# EAGLE design ADC3_10M (EAGLE 9.6.2)
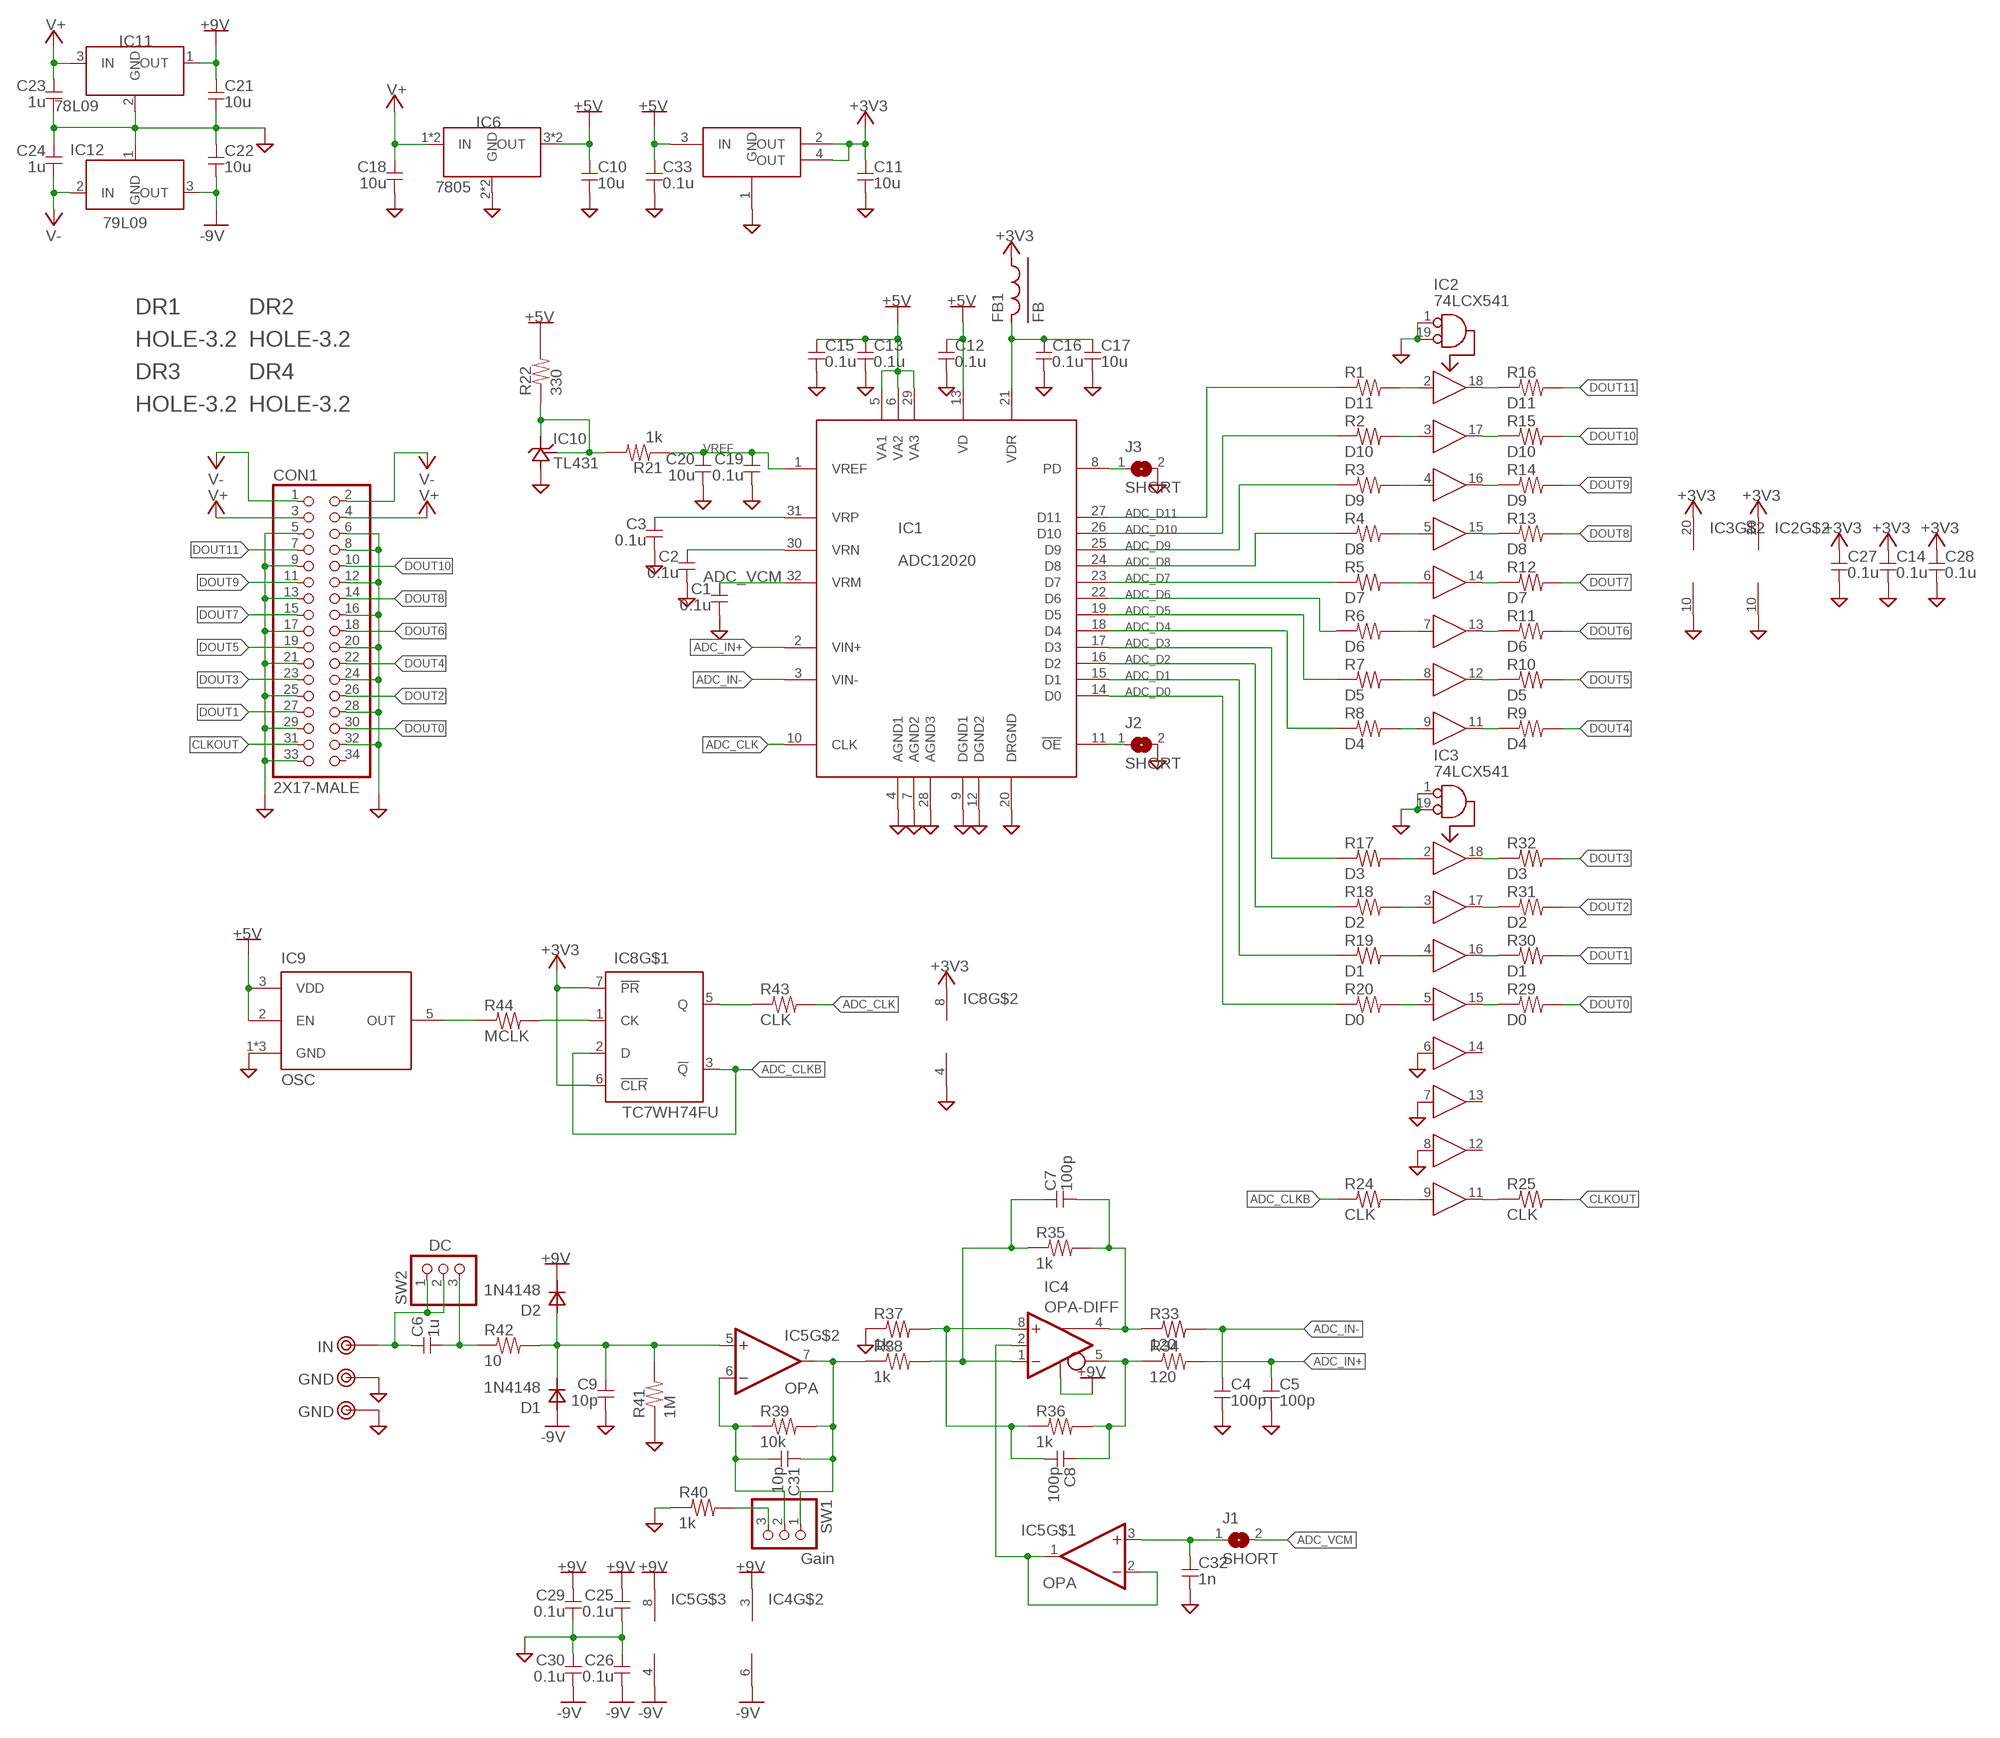
[diagram p0: schematic, sheet 1]

## Parts
C1  0.1u  C-1608  [1608]
C2  0.1u  C-1608  [1608]
C3  0.1u  C-1608  [1608]
C4  100p  C-1608  [1608]
C5  100p  C-1608  [1608]
C6  1u  C-5  [C050]
C7  100p  C-1608  [1608]
C8  100p  C-1608  [1608]
C9  10p  C-1608  [1608]
C10  10u  C-3216  [3216]
C11  10u  C-3216  [3216]
C12  0.1u  C-1608  [1608]
C13  0.1u  C-1608  [1608]
C14  0.1u  C-1608  [1608]
C15  0.1u  C-1608  [1608]
C16  0.1u  C-1608  [1608]
C17  10u  C-2012  [2012]
C18  10u  C-3216  [3216]
C19  0.1u  C-1608  [1608]
C20  10u  C-3216  [3216]
C21  10u  C-2012  [2012]
C22  10u  C-2012  [2012]
C23  1u  C-1608  [1608]
C24  1u  C-1608  [1608]
C25  0.1u  C-1608  [1608]
C26  0.1u  C-1608  [1608]
C27  0.1u  C-1608  [1608]
C28  0.1u  C-1608  [1608]
C29  0.1u  C-1608  [1608]
C30  0.1u  C-1608  [1608]
C31  10p  C-1608  [1608]
C32  1n  C-1608  [1608]
C33  0.1u  C-1608  [1608]
CON1  2X17-MALE  [2X17/90-SWAPPED]
D1  1N4148  DIODE-1N4148W  [SOD123]
D2  1N4148  DIODE-1N4148W  [SOD123]
DR1  HOLE-3.2  [HOLE_3.2]
DR2  HOLE-3.2  [HOLE_3.2]
DR3  HOLE-3.2  [HOLE_3.2]
DR4  HOLE-3.2  [HOLE_3.2]
FB1  FB  [1608-J]
IC1  ADC12020  [TQFP32-08]
IC2  74LCX541  [TSSOP20]
IC3  74LCX541  [TSSOP20]
IC4  OPA-DIFF  [SOP8]
IC5  OPA  OPA-2-SOP  [SOP8]
IC6  7805  78X-3  [TO220-SOP-DUAL]
IC7  AZ1086H-3.3  [SOT223]
IC8  TC7WH74FU  [SSOP8-P-0.65]
IC9  OSC  [MY_OSC]
IC10  TL431  [TO-92]
IC11  78L09  78LX  [TO-92]
IC12  79L09  79LX  [TO-92]
J1  SHORT  SJ-1608  [1608-J]
J2  SHORT  SJ-1608  [1608-J]
J3  SHORT  SJ-1608  [1608-J]
R1  D11  R-1608J  [1608-J]
R2  D10  R-1608J  [1608-J]
R3  D9  R-1608J  [1608-J]
R4  D8  R-1608J  [1608-J]
R5  D7  R-1608J  [1608-J]
R6  D6  R-1608J  [1608-J]
R7  D5  R-1608J  [1608-J]
R8  D4  R-1608J  [1608-J]
R9  D4  R-1608J  [1608-J]
R10  D5  R-1608J  [1608-J]
R11  D6  R-1608J  [1608-J]
R12  D7  R-1608J  [1608-J]
R13  D8  R-1608J  [1608-J]
R14  D9  R-1608J  [1608-J]
R15  D10  R-1608J  [1608-J]
R16  D11  R-1608J  [1608-J]
R17  D3  R-1608J  [1608-J]
R18  D2  R-1608J  [1608-J]
R19  D1  R-1608J  [1608-J]
R20  D0  R-1608J  [1608-J]
R21  1k  R-1608  [1608]
R22  330  R-1608  [1608]
R24  CLK  R-1608J  [1608-J]
R25  CLK  R-1608J  [1608-J]
R29  D0  R-1608J  [1608-J]
R30  D1  R-1608J  [1608-J]
R31  D2  R-1608J  [1608-J]
R32  D3  R-1608J  [1608-J]
R33  120  R-1608  [1608]
R34  120  R-1608  [1608]
R35  1k  R-1608  [1608]
R36  1k  R-1608  [1608]
R37  1k  R-1608  [1608]
R38  1k  R-1608  [1608]
R39  10k  R-1608  [1608]
R40  1k  R-1608  [1608]
R41  1M  R-1608  [1608]
R42  10  R-1608  [1608]
R43  CLK  R-1608J  [1608-J]
R44  MCLK  R-1608J  [1608-J]
SW1  Gain  SW-1X3  [1X03]
SW2  DC  SW-1X3  [1X03]
TP1  IN  TESTPIN  [TESTPIN]
TP2  GND  TESTPIN  [TESTPIN]
TP3  GND  TESTPIN  [TESTPIN]

## Nets
+3V3: C11.1 C14.1 C27.1 C28.1 FB1.1 IC2.20(V+) IC3.20(V+) IC7.2(OUT) IC7.4(OUT) IC8.6(!CLR) IC8.7(!PR) IC8.8(V+)
+5V: C10.1 C12.1 C13.1 C15.1 C33.1 IC1.5(VA1) IC1.6(VA2) IC1.13(VD) IC1.29(VA3) IC6.3(OUT) IC6.6(OUT) IC7.3(IN) IC9.2(EN) IC9.3(VDD) R22.2
+9V: C21.1 C25.1 C29.1 D2.2(K) IC4.3(V+) IC4.7(EN) IC5.8(V+) IC11.1(OUT)
-9V: C22.2 C26.2 C30.2 D1.1(A) IC4.6(V-) IC5.4(V-) IC12.3(OUT)
ADC_CLK: IC1.10(CLK) R43.2
ADC_CLKB: IC8.2(D) IC8.3(!Q) R24.1
ADC_D0: IC1.14(D0) R20.1
ADC_D1: IC1.15(D1) R19.1
ADC_D2: IC1.16(D2) R18.1
ADC_D3: IC1.17(D3) R17.1
ADC_D4: IC1.18(D4) R8.1
ADC_D5: IC1.19(D5) R7.1
ADC_D6: IC1.22(D6) R6.1
ADC_D7: IC1.23(D7) R5.1
ADC_D8: IC1.24(D8) R4.1
ADC_D9: IC1.25(D9) R3.1
ADC_D10: IC1.26(D10) R2.1
ADC_D11: IC1.27(D11) R1.1
ADC_IN+: C5.1 IC1.2(VIN+) R34.2
ADC_IN-: C4.1 IC1.3(VIN-) R33.2
ADC_VCM: C1.1 IC1.32(VRM) J1.2
CLKOUT: CON1.31 R25.2
DOUT0: CON1.30 R29.2
DOUT1: CON1.27 R30.2
DOUT2: CON1.26 R31.2
DOUT3: CON1.23 R32.2
DOUT4: CON1.22 R9.2
DOUT5: CON1.19 R10.2
DOUT6: CON1.18 R11.2
DOUT7: CON1.15 R12.2
DOUT8: CON1.14 R13.2
DOUT9: CON1.11 R14.2
DOUT10: CON1.10 R15.2
DOUT11: CON1.7 R16.2
GND: C1.2 C2.2 C3.2 C4.2 C5.2 C9.2 C10.2 C11.2 C12.2 C13.2 C14.2 C15.2 C16.2 C17.2 C18.2 C19.2 C20.2 C21.2 C22.1 C23.2 C24.1 C25.2 C26.1 C27.2 C28.2 C29.2 C30.1 C32.2 C33.2 CON1.5 CON1.6 CON1.8 CON1.9 CON1.12 CON1.13 CON1.16 CON1.17 CON1.20 CON1.21 CON1.24 CON1.25 CON1.28 CON1.29 CON1.32 CON1.33 IC1.4(AGND1) IC1.7(AGND2) IC1.9(DGND1) IC1.12(DGND2) IC1.20(DRGND) IC1.28(AGND3) IC2.1(!OE1) IC2.10(V-) IC2.19(!OE2) IC3.1(!OE1) IC3.6(IN5) IC3.7(IN6) IC3.8(IN7) IC3.10(V-) IC3.19(!OE2) IC6.2(GND) IC6.5(GND) IC7.1(GND) IC8.4(V-) IC9.1(GND) IC9.4(GND) IC9.6(GND) IC10.2(GND) IC11.2(GND) IC12.1(GND) J2.2 J3.2 R37.1 R40.1 R41.1 TP2.1 TP3.1
N$1: C7.2 IC4.4(+OUT) R33.1 R35.2
N$2: C8.1 IC4.5(-OUT) R34.1 R36.2
N$3: C8.2 IC4.8(+IN) R36.1 R37.2
N$4: R40.2 SW1.3
N$12: C7.1 IC4.1(-IN) R35.1 R38.2
N$13: IC4.2(CM) IC5.1(OUT) IC5.2(-IN)
N$14: C32.1 IC5.3(+IN) J1.1
N$15: C31.1 IC5.7(OUT) R38.1 R39.2 SW1.1
N$16: C31.2 IC5.6(-IN) R39.1 SW1.2
N$17: IC2.2(IN1) R1.2
N$18: IC2.3(IN2) R2.2
N$19: IC2.4(IN3) R3.2
N$20: IC2.5(IN4) R4.2
N$21: IC2.6(IN5) R5.2
N$22: IC2.7(IN6) R6.2
N$23: IC2.8(IN7) R7.2
N$24: IC2.9(IN8) R8.2
N$25: IC2.11(OUT8) R9.1
N$26: IC2.12(OUT7) R10.1
N$27: IC2.13(OUT6) R11.1
N$28: IC2.14(OUT5) R12.1
N$29: IC2.15(OUT4) R13.1
N$30: IC2.16(OUT3) R14.1
N$31: IC2.17(OUT2) R15.1
N$32: IC2.18(OUT1) R16.1
N$33: C16.1 C17.1 FB1.2 IC1.21(VDR)
N$34: C6.1 SW2.1 SW2.2 TP1.1
N$35: C6.2 R42.1 SW2.3
N$37: C9.1 D1.2(K) D2.1(A) IC5.5(+IN) R41.2 R42.2
N$38: IC1.11(!OE) J2.1
N$39: IC1.8(PD) J3.1
N$44: IC10.1(REF) IC10.3(OUT) R21.2 R22.1
N$49: IC3.2(IN1) R17.2
N$50: IC3.3(IN2) R18.2
N$51: IC3.4(IN3) R19.2
N$52: IC3.5(IN4) R20.2
N$56: IC3.9(IN8) R24.2
N$57: IC3.11(OUT8) R25.1
N$61: IC3.15(OUT4) R29.1
N$62: IC3.16(OUT3) R30.1
N$63: IC3.17(OUT2) R31.1
N$64: IC3.18(OUT1) R32.1
N$65: IC8.5(Q) R43.1
N$66: C2.1 IC1.30(VRN)
N$67: C3.1 IC1.31(VRP)
N$68: IC8.1(CK) R44.2
N$69: IC9.5(OUT) R44.1
V+: C18.1 C23.1 CON1.3 CON1.4 IC6.1(IN) IC6.4(IN) IC11.3(IN)
V-: C24.2 CON1.1 CON1.2 IC12.2(IN)
VREF: C19.1 C20.1 IC1.1(VREF) R21.1
Unconnected: CON1.34 IC3.12(OUT7) IC3.13(OUT6) IC3.14(OUT5)

## Library data of the parts
C1-C33 = my_rcl:C
CON1 = my_connector:2X17-MALE
D1 D2 = my_rcl:DIODE
DR1-DR4 = my_connector:HOLE-3.2
FB1 = my_rcl:FB
IC1 = my_ic:ADC12020
IC2 IC3 = my_ic:74LCX541
IC4 = my_ic:OPA-DIFF
IC5 = my_ic:OPA-2
IC6 = my_ic:78X
IC7 = my_ic:AZ1086?-*
IC8 = my_ic:TC7WH74FU
IC9 = my_ic:OSC
IC10 = my_ic:TL431
IC11 = my_ic:78LX
IC12 = my_ic:79LX
J1-J3 = my_rcl:SJ
R1-R22 R24 R25 R29-R44 = my_rcl:R
SW1 SW2 = my_connector:SW-1X3: PIN HEADER
TP1-TP3 = my_connector:TESTPIN

## Board
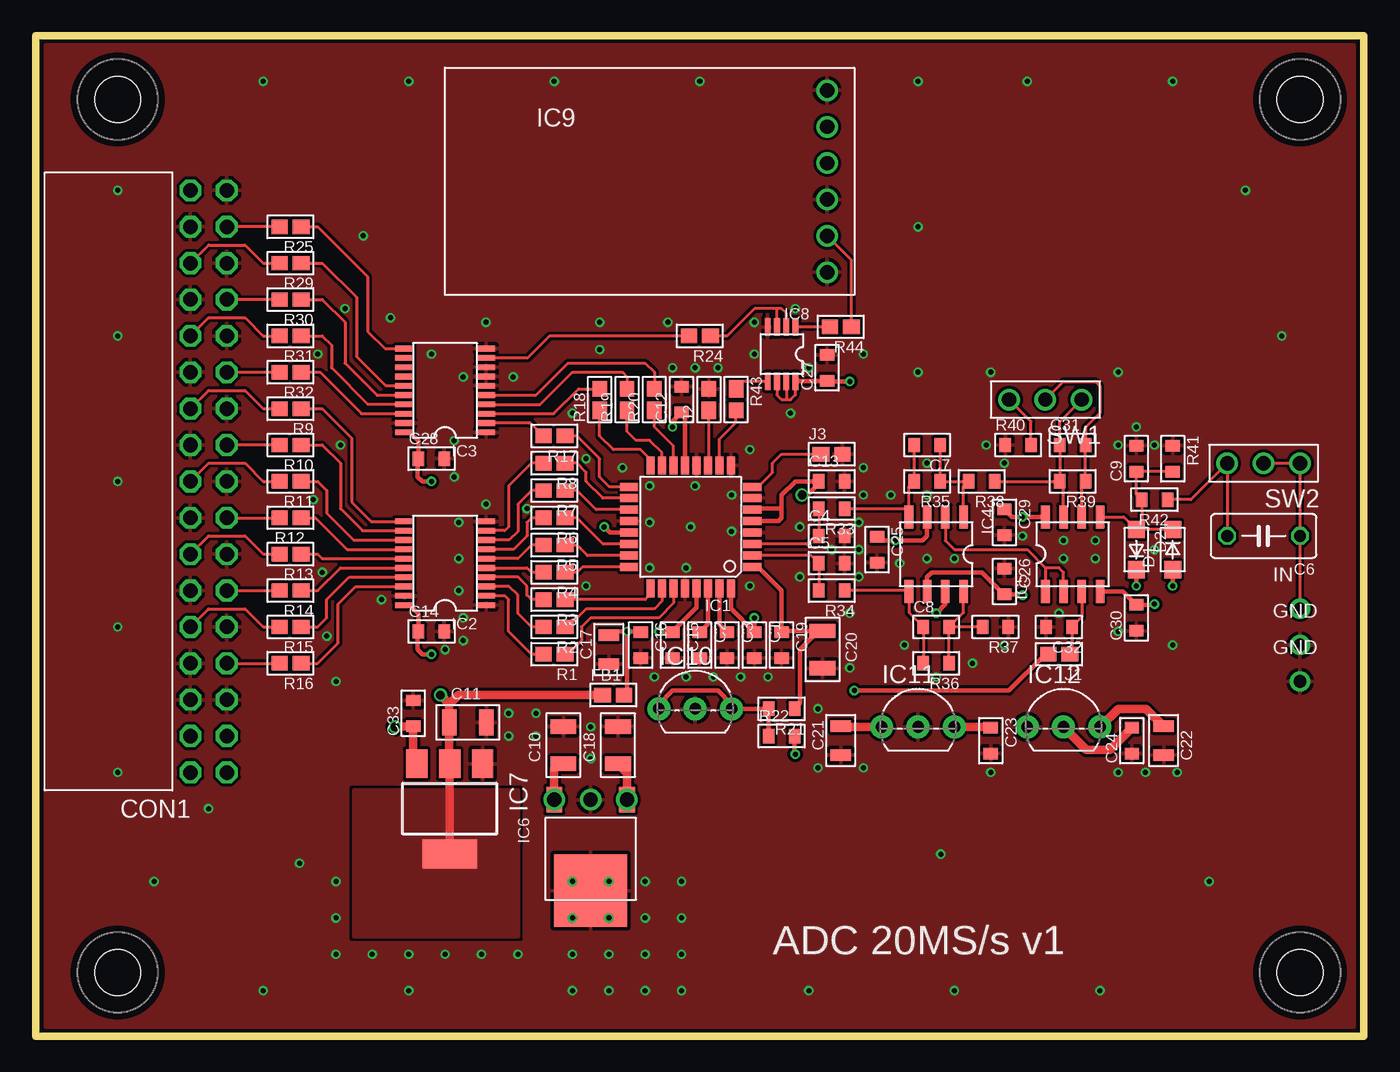
[diagram p1: board, top side]
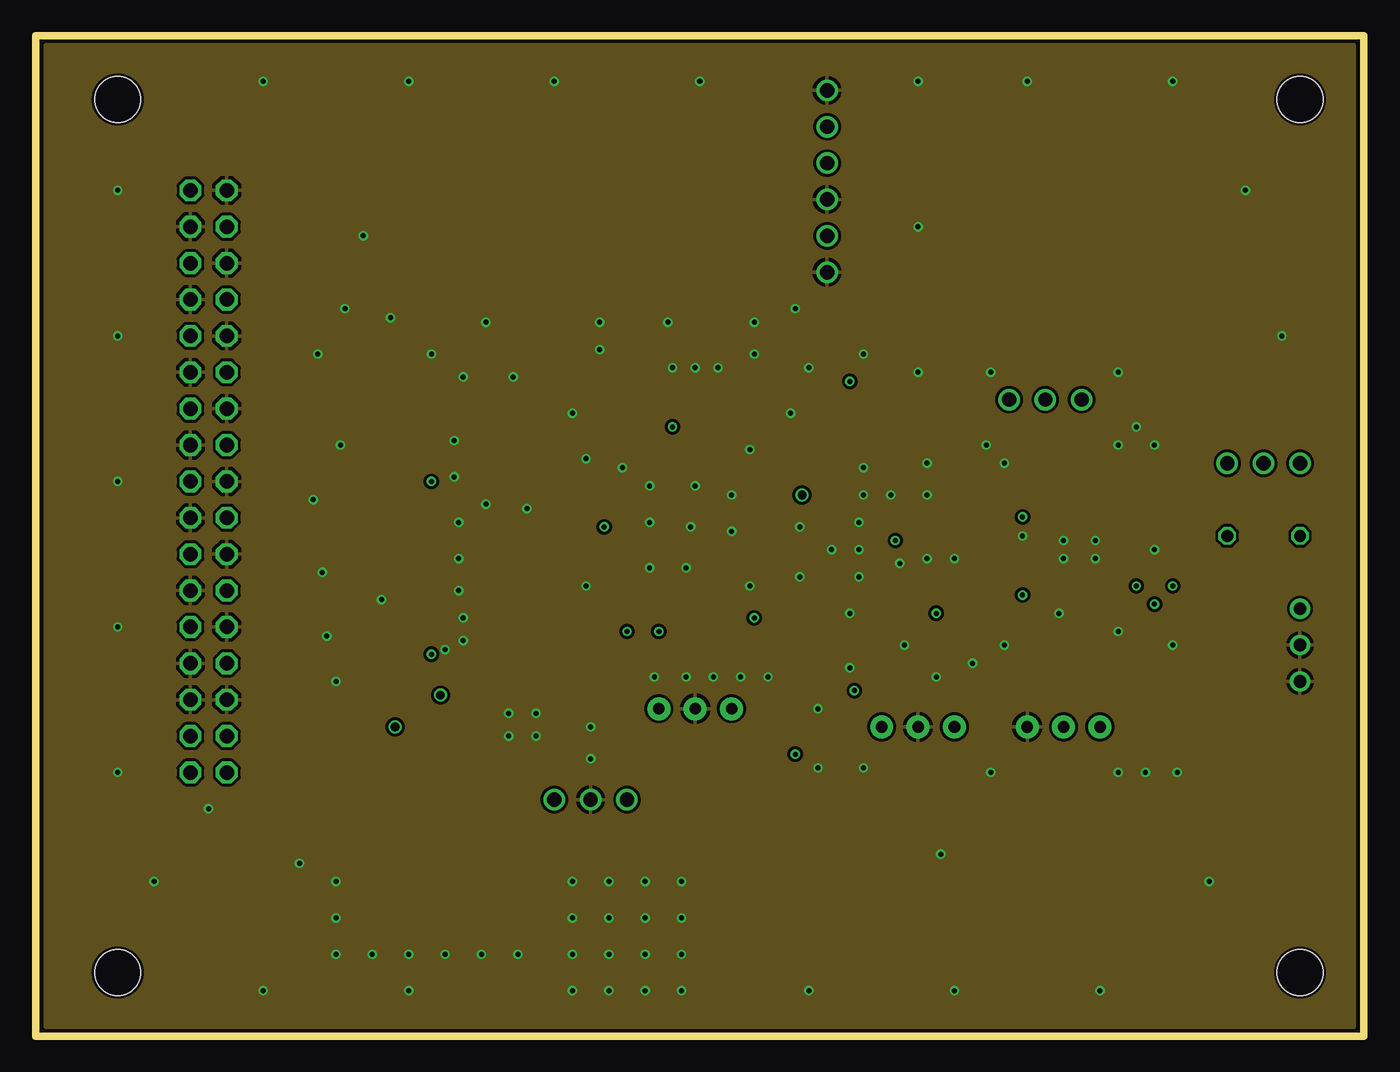
[diagram p2: board, inner layer Route2]
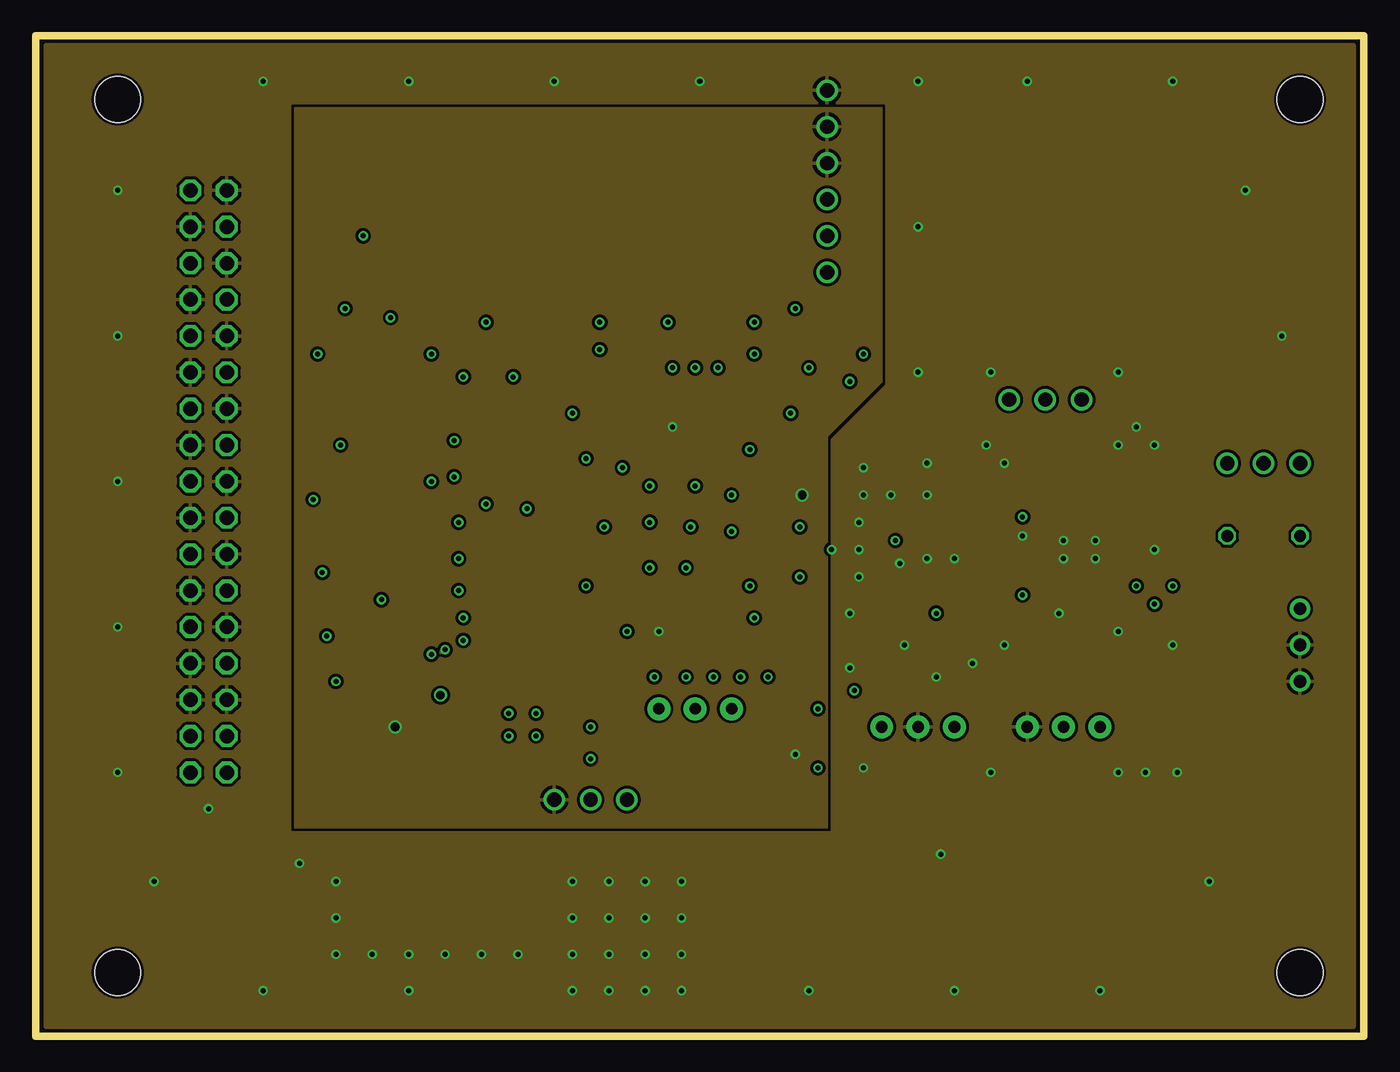
[diagram p3: board, inner layer Route15]
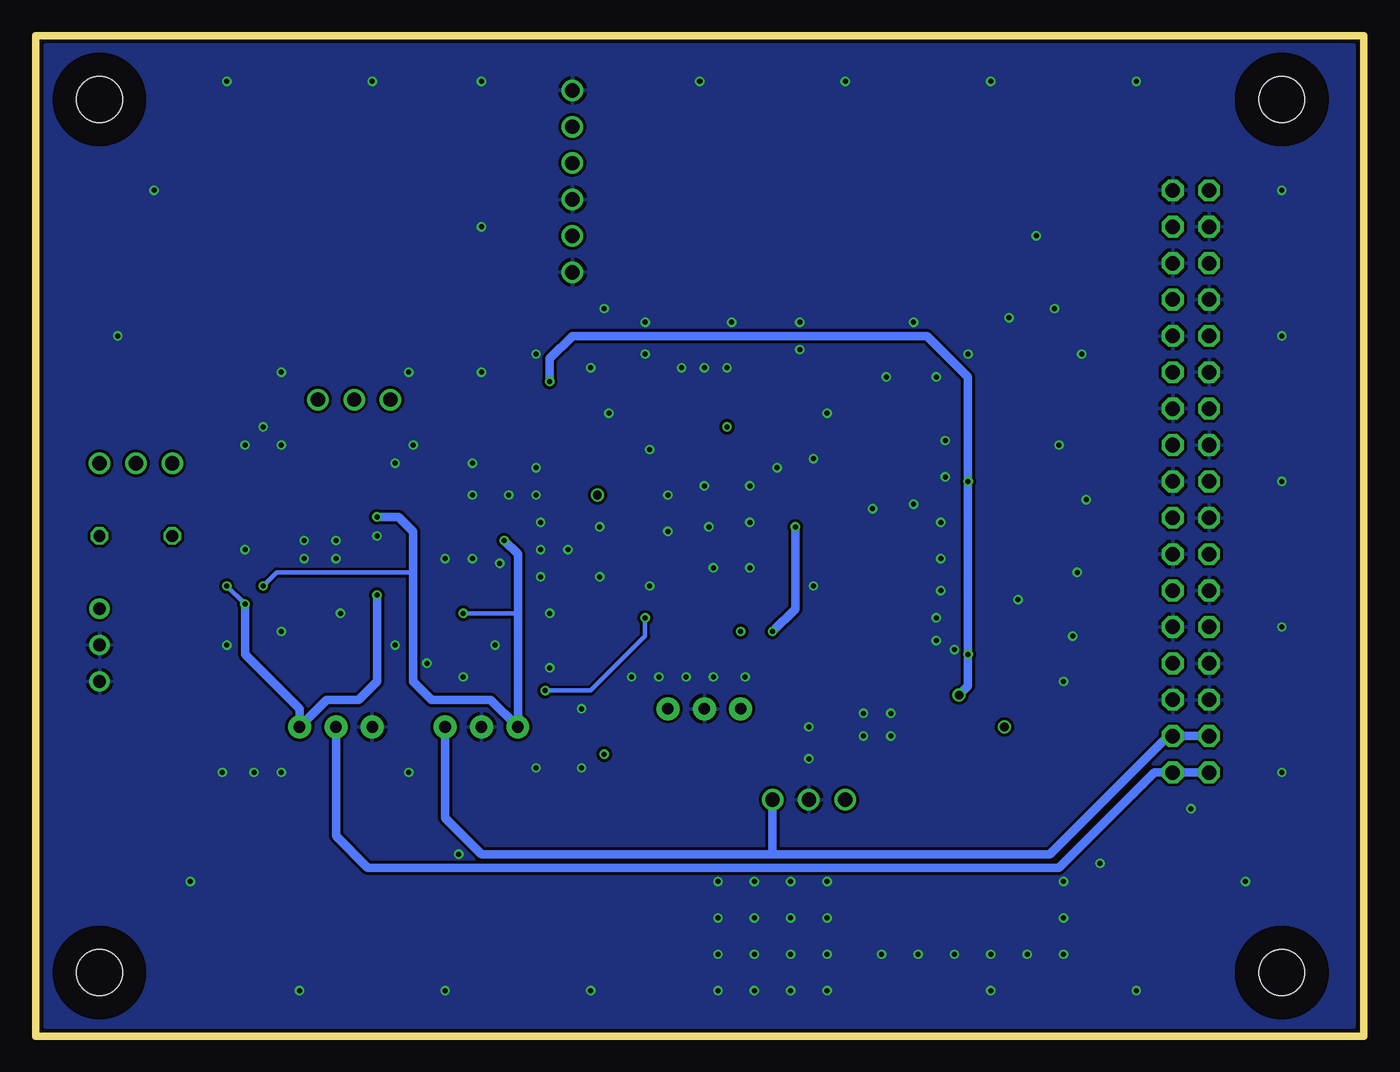
[diagram p4: board, bottom side, seen from below]

Size 92.71 x 69.85 mm. Coordinates in mm from the lower left corner, seen from the top.
Outline: 0,69.85 0,0 92.71,0 92.71,69.85 0,69.85
Copper layers (1*2*15*16): Top 0.035mm / dielectric 0.2mm / Route2 0.0175mm / dielectric 1.065mm / Route15 0.0175mm / dielectric 0.2mm / Bottom 0.035mm
Design rules "JLCPCB_4layer": minimum track width 6mil, minimum drill 0.3mm, track to track 6mil, track to pad 6mil, pad to pad 6mil, via to via 8mil, smd to smd 0mil, copper to edge 0.2mm, drill to drill 0.4mm, minimum pad ring 8mil, minimum via ring 6mil, stop-mask expansion 4mil, vias tented up to drill 1mm, thermal gap 10mil

### Footprints (pad centres in the part's own frame; a part is rotated, then mirrored left to right if it is on the bottom)
1608 = smd 0.8 x 1: 1 -0.9,0; 2 0.9,0
C050 = drill 0.813 octagon: 1 -2.54,0; 2 2.54,0
3216 = smd 1 x 1.8: 1 -1.3,0; 2 1.3,0
2012 = smd 0.8 x 1.4: 1 -1,0; 2 1,0
2X17/90-SWAPPED = drill 1.016 octagon: 1 -20.32,-6.35; 2 -20.32,-3.81; 3 -17.78,-6.35; 4 -17.78,-3.81; 5 -15.24,-6.35; 6 -15.24,-3.81; 7 -12.7,-6.35; 8 -12.7,-3.81; 9 -10.16,-6.35; 10 -10.16,-3.81; 11 -7.62,-6.35; 12 -7.62,-3.81; 13 -5.08,-6.35; 14 -5.08,-3.81; 15 -2.54,-6.35; 16 -2.54,-3.81; 17 0,-6.35; 18 0,-3.81; 19 2.54,-6.35; 20 2.54,-3.81; 21 5.08,-6.35; 22 5.08,-3.81; 23 7.62,-6.35; 24 7.62,-3.81; 25 10.16,-6.35; 26 10.16,-3.81; 27 12.7,-6.35; 28 12.7,-3.81; 29 15.24,-6.35; 30 15.24,-3.81; 31 17.78,-6.35; 32 17.78,-3.81; 33 20.32,-6.35; 34 20.32,-3.81
SOD123 = smd 1.2 x 1.2: 1 -1.4,0; 2 1.4,0
HOLE_3.2 = hole 3.2: 0,0
1608-J = smd 1.2 x 1: 1 -0.75,0 | smd 1.1 x 1: 2 0.75,0
TQFP32-08 = smd 1.27 x 0.559: 1 -4.293,2.8; 2 -4.293,2; 3 -4.293,1.2; 4 -4.293,0.4; 5 -4.293,-0.4; 6 -4.293,-1.2; 7 -4.293,-2; 8 -4.293,-2.8; 17 4.293,-2.8; 18 4.293,-2; 19 4.293,-1.2; 20 4.293,-0.4; 21 4.293,0.4; 22 4.293,1.2; 23 4.293,2; 24 4.293,2.8 | smd 0.559 x 1.27: 9 -2.8,-4.293; 10 -2,-4.293; 11 -1.2,-4.293; 12 -0.4,-4.293; 13 0.4,-4.293; 14 1.2,-4.293; 15 2,-4.293; 16 2.8,-4.293; 25 2.8,4.293; 26 2,4.293; 27 1.2,4.293; 28 0.4,4.293; 29 -0.4,4.293; 30 -1.2,4.293; 31 -2,4.293; 32 -2.8,4.293
TSSOP20 = smd 0.4 x 1.3: 1 -2.925,-2.85; 2 -2.275,-2.85; 3 -1.625,-2.85; 4 -0.975,-2.85; 5 -0.325,-2.85; 6 0.325,-2.85; 7 0.975,-2.85; 8 1.625,-2.85; 9 2.275,-2.85; 10 2.925,-2.85; 11 2.925,2.85; 12 2.275,2.85; 13 1.625,2.85; 14 0.975,2.85; 15 0.325,2.85; 16 -0.325,2.85; 17 -0.975,2.85; 18 -1.625,2.85; 19 -2.275,2.85; 20 -2.925,2.85
SOP8 = smd 0.6 x 1.6: 1 -1.905,-2.6; 2 -0.635,-2.6; 3 0.635,-2.6; 4 1.905,-2.6; 5 1.905,2.6; 6 0.635,2.6; 7 -0.635,2.6; 8 -1.905,2.6
TO220-SOP-DUAL = smd 1.1 x 1.8: 1 -2.54,0; 3 2.54,0 | smd 5.08 x 5.08: 2 0,6.35 | drill 1: 4 -2.54,0; 5 0,0; 6 2.54,0
SOT223 = smd 1.5 x 2: 1 -2.3,-3.15; 2 0,-3.15; 3 2.3,-3.15 | smd 3.8 x 2: 4 0,3.15
SSOP8-P-0.65 = smd 0.4 x 1.2: 1 -0.975,-1.9; 2 -0.325,-1.9; 3 0.325,-1.9; 4 0.975,-1.9; 5 0.975,1.9; 6 0.325,1.9; 7 -0.325,1.9; 8 -0.975,1.9
MY_OSC = drill 1: 1 0,6.35; 2 0,3.81; 3 0,1.27; 4 0,-1.27; 5 0,-3.81; 6 0,-6.35
TO-92 = drill 0.813 pad 1.6: 1 -2.54,0; 2 0,0; 3 2.54,0
1X03 = drill 1: 1 -2.54,0; 2 0,0; 3 2.54,0
TESTPIN = drill 0.9 pad 1.4: 1 0,0

### Placement (x,y rotation side)
C1  50.16,27.31 270 top
C2  46.35,27.31 270 top
C3  48.26,27.31 270 top
C4  55.56,34.92 0 top
C5  55.56,33.02 0 top
C6  85.73,34.92 180 top
C7  62.23,41.27 180 top
C8  62.86,28.58 0 top
C9  76.84,40.32 90 top
C10  36.83,20.32 90 top
C11  30.16,21.91 0 top
C12  45.09,44.45 90 top
C13  55.56,38.73 0 top
C14  27.62,28.26 0 top
C15  44.45,27.31 270 top
C16  42.23,27.31 270 top
C17  40,26.99 270 top
C18  40.64,20.32 90 top
C19  52.07,27.31 270 top
C20  54.93,26.99 270 top
C21  56.2,20.64 270 top
C22  78.74,20.64 90 top
C23  66.68,20.64 270 top
C24  76.52,20.64 90 top
C25  58.74,33.97 270 top
C26  67.63,31.75 270 top
C27  55.24,46.67 90 top
C28  27.62,40.32 0 top
C29  67.63,35.88 270 top
C30  76.84,29.21 90 top
C31  72.39,41.27 0 top
C32  71.44,28.58 180 top
C33  26.35,22.54 90 top
CON1  6.98,38.73 90 top
D1  79.38,33.97 90 top
D2  76.84,33.97 270 top
DR1  5.71,4.45 0 top
DR2  88.27,4.45 0 top
DR3  5.71,65.41 0 top
DR4  88.27,65.41 0 top
FB1  40.32,23.81 0 top
IC1  45.72,35.56 180 top
IC2  28.58,33.02 90 top
IC3  28.58,45.09 90 top
IC4  62.86,33.66 180 top
IC5  72.39,33.66 0 top
IC6  38.73,16.51 180 top
IC7  28.89,15.88 180 top
IC8  52.07,47.62 180 top
IC9  55.24,59.69 0 top
IC10  46.04,22.86 0 top
IC11  61.59,21.59 0 top
IC12  71.76,21.59 0 top
J1  71.44,26.67 180 top
J2  46.99,44.45 90 top
J3  55.56,40.64 0 top
R1  36.2,26.67 180 top
R2  36.2,28.58 180 top
R3  36.2,30.48 180 top
R4  36.2,32.38 180 top
R5  36.2,34.29 180 top
R6  36.2,36.2 180 top
R7  36.2,38.1 180 top
R8  36.2,40 180 top
R9  17.78,43.81 180 top
R10  17.78,41.27 180 top
R11  17.78,38.73 180 top
R12  17.78,36.2 180 top
R13  17.78,33.66 180 top
R14  17.78,31.12 180 top
R15  17.78,28.58 180 top
R16  17.78,26.04 180 top
R17  36.2,41.91 180 top
R18  39.37,44.45 90 top
R19  41.27,44.45 90 top
R20  43.18,44.45 90 top
R21  52.07,22.86 180 top
R22  52.07,20.96 0 top
R24  46.35,48.89 180 top
R25  17.78,56.52 180 top
R29  17.78,53.98 180 top
R30  17.78,51.43 180 top
R31  17.78,48.89 180 top
R32  17.78,46.35 180 top
R33  55.56,36.83 180 top
R34  55.56,31.12 180 top
R35  62.23,38.73 180 top
R36  62.86,26.04 180 top
R37  66.99,28.58 180 top
R38  66.04,38.73 180 top
R39  72.39,38.73 180 top
R40  68.58,41.27 0 top
R41  79.38,40.32 270 top
R42  78.11,37.46 180 top
R43  48.89,44.45 270 top
R44  56.2,49.53 180 top
SW1  70.48,44.45 180 top
SW2  85.73,40 180 top
TP1  88.27,29.85 0 top
TP2  88.27,24.77 0 top
TP3  88.27,27.31 0 top

### Tracks (layer width: path | path; a pad name or v marks a point on that pad's centre or on a via)
+3V3  (via drill 0.35, 0.6)
  Top 0.203: IC8.6 51.74,44.77 52.07,44.45 52.39,44.45 | 52.39,44.45 52.7,44.45 53.04,44.79 IC8.8 | IC8.7 52.39,44.46 52.39,44.45
  Top 0.305: v56.83,45.72 55.3,45.72 C27.1 55.2,45.73 IC8.8 | v27.62,26.67 26.99,26.67 26.67,26.99 26.67,28.21 C14.1 26.72,29.48 26.1,30.1 IC2.20 | v27.62,38.73 26.99,38.73 26.67,39.05 26.67,40.27 C28.1 26.72,41.54 26.1,42.16 IC3.20
  Top 0.61: FB1.1 29.53,23.81 28.86,23.15 | 28.86,23.15 C11.1 28.86,19.06 IC7.2 IC7.4 | v28.26,23.81 28.89,23.18 28.89,23.12 28.86,23.15
  Bottom 0.61: v56.83,45.72 56.83,47.31 55.24,48.89 30.48,48.89 27.62,46.04 v27.62,38.73 v27.62,26.67 27.62,24.45 v28.26,23.81
  pour Top (isolate 0.305, no thermals): 33.66,17.15 22.23,17.15 22.23,6.98 33.66,6.98
+5V  (via drill 0.35, 0.6)
  Top 0.305: IC1.29 46.12,29.93 44.45,28.26 C15.1 43.55,28.21 v43.5,28.26 | IC1.13 45.32,43.31 C12.1 44.45,42.91 v44.45,42.54 | IC1.5 51.84,35.96 52.07,36.2 52.07,36.83 | IC1.6 50.08,36.83 52.07,36.83 | R22.2 52.97,19.74 v53.02,19.69 | 52.07,36.83 52.07,37.78 53.02,38.73 C13.1 54.66,38.58 53.87,37.78 v53.5,37.78
  Top 0.61: IC6.6 36.2,18.7 36.51,19.02 C10.1 | v25.08,21.59 25.14,21.64 C33.1 26.35,19.27 IC7.3
  pour Route15 (isolate 0.203): 59.05,64.77 18.1,64.77 18.1,14.61 55.24,14.61 55.24,41.91 59.05,45.72
+9V  (via drill 0.35)
  Top 0.305: IC4.3 62.23,34.92 61.91,34.61 v60.01,34.61 59,34.61 C25.1 | IC5.8 v68.9,36.25 68.15,36.25 C29.1 | D2.2 v76.84,31.43 | IC4.7 63.5,30.16 v62.86,29.53
  Top 0.61: IC11.1 56.24,21.59 C21.1
  Bottom 0.305: v76.84,31.43 75.88,32.38 66.36,32.38 | v62.86,29.53 59.05,29.53
  Bottom 0.61: v68.9,36.25 67.37,36.25 66.36,35.24 66.36,32.38 66.36,24.77 65.09,23.5 60.96,23.5 IC11.1 59.05,29.53 59.05,33.66 v60.01,34.61
-9V  (via drill 0.35)
  Top 0.305: IC4.6 62.23,32.07 62.55,32.38 66.04,32.38 67.58,30.85 C26.2 68.84,30.85 v68.9,30.8 | IC5.4 75.89,31.06 C30.2 78.05,30.11 v78.11,30.16 | D1.1 v79.38,31.43
  Top 0.61: IC12.3 75.57,22.86 77.52,22.86 C22.2
  Bottom 0.305: v79.38,31.43 v78.11,30.16
  Bottom 0.61: v68.9,30.8 68.9,24.77 70.17,23.5 72.39,23.5 IC12.3 74.3,22.86 78.11,26.67 v78.11,30.16
ADC_CLK
  Top 0.203: IC1.10 47.72,41.69 48.89,42.86 R43.2
ADC_CLKB
  Top 0.203: R24.1 48.26,48.89 50.16,50.8 51.75,50.8 | IC8.2 52.39,50.48 52.07,50.8 51.75,50.8 | IC8.3 51.74,50.79 51.75,50.8
ADC_D0
  Top 0.203: IC1.14 44.52,41.2 43.18,42.54 R20.1
ADC_D1
  Top 0.203: IC1.15 43.72,40.73 42.86,41.59 41.91,41.59 41.27,42.23 R19.1
ADC_D2
  Top 0.203: IC1.16 42.92,40.27 42.23,40.96 40.32,40.96 39.37,41.91 R18.1
ADC_D3
  Top 0.203: IC1.17 40.06,38.36 39.37,39.05 39.37,40.32 37.78,41.91 R17.1
ADC_D4
  Top 0.203: IC1.18 39.59,37.56 38.42,38.73 38.42,39.37 37.78,40 R8.1
ADC_D5
  Top 0.203: IC1.19 39.12,36.76 37.78,38.1 R7.1
ADC_D6
  Top 0.203: IC1.22 39.62,34.36 37.78,36.2 R6.1
ADC_D7
  Top 0.203: IC1.23 38.51,33.56 37.78,34.29 R5.1
ADC_D8
  Top 0.203: IC1.24 38.16,32.76 37.78,32.38 R4.1
ADC_D9
  Top 0.203: IC1.25 42.92,30.86 42.54,30.48 R3.1
ADC_D10
  Top 0.203: IC1.26 43.72,30.39 43.18,29.85 38.42,29.85 37.15,28.58 R2.1
ADC_D11
  Top 0.203: IC1.27 44.52,30.23 43.5,29.21 38.73,29.21 38.1,28.58 38.1,27.62 37.15,26.67 R1.1
ADC_IN+
  Top 0.203: IC1.2 54.12,33.56 C5.1 R34.2
ADC_IN-
  Top 0.203: IC1.3 53.82,34.36 54.39,34.92 C4.1 R33.2
ADC_VCM  (via drill 0.35)
  Top 0.305: IC1.32 48.52,29.85 C1.1 v50.16,29.21 | J1.2 70.48,26.67 67.95,24.13 v57.15,24.13
  Bottom 0.305: v57.15,24.13 53.98,24.13 50.16,27.94 v50.16,29.21
CLKOUT
  Top 0.203: R25.2 CON1.31
DOUT0
  Top 0.203: CON1.30 12.06,55.24 14.61,55.24 15.88,53.98 R29.2
DOUT1
  Top 0.203: R30.2 CON1.27
DOUT2
  Top 0.203: CON1.26 12.06,50.16 14.61,50.16 15.88,48.89 R31.2
DOUT3
  Top 0.203: CON1.23 R32.2
DOUT4
  Top 0.203: CON1.22 12.06,45.09 14.61,45.09 15.88,43.81 R9.2
DOUT5
  Top 0.203: R10.2 CON1.19
DOUT6
  Top 0.203: CON1.18 12.06,40 14.61,40 15.88,38.73 R11.2
DOUT7
  Top 0.203: CON1.15 R12.2
DOUT8
  Top 0.203: CON1.14 12.06,34.92 14.61,34.92 15.88,33.66 R13.2
DOUT9
  Top 0.203: CON1.11 R14.2
DOUT10
  Top 0.203: CON1.10 12.06,29.85 14.61,29.85 15.88,28.58 R15.2
DOUT11
  Top 0.203: CON1.7 R16.2
GND  (via drill 0.35)
  other vias: 21.59,50.8 19.69,47.62 21.27,41.27 19.37,37.46 20,32.38 20.32,27.94 31.43,37.15 29.53,35.88 24.13,30.48 28.58,26.99 29.85,27.62 29.85,29.21 29.21,39.05 29.21,41.59 31.43,49.85 29.85,46.04 33.34,46.04 27.62,47.62 29.53,33.34 29.53,31.12 38.42,31.43 34.29,36.83 42.86,35.88 46.04,38.42 48.58,37.78 48.58,35.24 45.4,32.7 45.72,35.56 42.86,38.42 42.86,32.7 49.85,31.43 40.96,39.69 37.46,43.5 38.42,40.32 49.85,40.96 44.45,46.67 46.04,46.67 47.62,46.67 57.78,39.69 57.78,37.78 57.47,35.88 57.47,32.07 57.47,33.97 60.32,33.02 43.18,25.08 45.4,25.08 47.31,25.08 49.21,25.08 51.12,25.08 56.83,25.72 54.61,22.86 54.61,18.73 57.78,18.73 66.68,18.42 75.57,18.42 77.47,18.42 79.69,18.42 67.63,27.31 71.44,29.53 68.9,34.92 75.57,28.26 79.38,27.31 71.76,34.61 73.98,34.61 73.98,33.34 71.76,33.34 62.23,33.34 64.14,33.34 62.23,37.78 62.23,40 66.36,41.27 67.63,40 75.57,41.27 76.84,42.54 78.11,41.27 78.11,33.97 53.98,46.67 50.16,47.62 57.78,47.62 52.7,43.5 24.77,50.16 22.86,55.88 20.96,24.77 12.06,15.88 18.42,12.06 37.46,10.79 37.46,8.26 40,8.26 40,10.79 42.54,10.79 42.54,8.26 42.54,5.71 40,5.71 37.46,5.71 45.09,10.79 45.09,8.26 45.09,5.71 37.46,3.17 40,3.17 42.54,3.17 45.09,3.17 20.96,10.79 20.96,8.26 20.96,5.71 23.5,5.71 26.04,5.71 28.58,5.71 31.12,5.71 33.66,5.71 33.02,22.54 33.02,20.96 34.92,22.54 38.73,21.59 34.92,20.96 38.73,19.37 63.18,12.7 39.37,47.94 39.37,49.85 44.13,49.85 53.02,50.8 50.16,49.85 26.04,66.68 15.88,66.68 5.71,59.05 5.71,48.89 5.71,38.73 5.71,28.58 5.71,18.42 8.26,10.79 15.88,3.17 26.04,3.17 53.98,3.17 64.14,3.17 74.3,3.17 81.92,10.79 87,48.89 84.45,59.05 79.38,66.68 69.22,66.68 61.59,66.68 36.2,66.68 46.35,66.68 61.59,56.52 61.59,46.35 62.86,25.08 65.41,26.04 55.56,33.97 53.34,35.56 53.34,32.07 56.83,29.53 59.69,37.78 75.57,46.35 66.68,46.35 60.64,27.31
  pour Top (isolate 0.203, rank 2): 92.08,69.22 0.64,69.22 0.64,0.64 92.08,0.64
  pour Bottom (isolate 0.203): 0.64,69.22 92.08,69.22 92.08,0.64 0.64,0.64
  pour Route2 (isolate 0.203): 0.64,69.22 0.64,0.64 92.08,0.64 92.08,69.22
  pour Route15 (isolate 0.203, rank 2): 0.64,69.22 0.64,0.64 92.08,0.64 92.08,69.22
N$1
  Top 0.203: R33.1 60.64,36.83 60.96,36.51 IC4.4 60.96,38.36 R35.2 C7.2
N$2
  Top 0.203: R34.1 60.9,31.12 IC4.5 60.96,29.58 C8.1 R36.2
N$3
  Top 0.203: R36.1 C8.2 | C8.2 64.77,29.58 IC4.8 | R37.2 C8.2
N$4
  Top 0.203: R40.2 69.48,42.91 SW1.3
N$12
  Top 0.203: C7.1 R35.1 65.09,38.73 | 65.09,38.73 R38.2 | IC4.1 64.77,38.42 65.09,38.73
N$13
  Top 0.203: IC4.2 63.5,34.61 64.14,33.97 69.22,33.97 70.48,32.7 | 70.48,32.7 IC5.1 | IC5.2 71.76,32.38 71.44,32.7 70.48,32.7
N$14
  Top 0.203: IC5.3 73.03,29.26 C32.1 72.34,26.82 J1.1
N$15
  Top 0.203: R38.1 71.44,38.73 | 71.44,38.73 R39.2 C31.1 71.49,42.91 SW1.1 | IC5.7 71.76,38.42 71.44,38.73
N$16
  Top 0.203: IC5.6 73.03,38.47 R39.1 C31.2 73.29,42.49 74.3,43.5 74.3,45.4 73.98,45.72 71.76,45.72 SW1.2
N$17
  Top 0.203: R1.2 34.61,26.67 33.02,28.26 33.02,30.48 32.75,30.75 IC2.2
N$18
  Top 0.203: R2.2 34.61,28.58 33.66,29.53 33.66,30.8 33.06,31.4 IC2.3
N$19
  Top 0.203: R3.2 34.61,30.48 34.29,30.8 34.29,31.43 33.68,32.05 IC2.4
N$20
  Top 0.203: R4.2 34.61,32.38 34.29,32.7 IC2.5
N$21
  Top 0.203: R5.2 34.61,34.29 33.66,33.34 IC2.6
N$22
  Top 0.203: R6.2 34.61,36.2 34.29,35.88 34.29,34.92 33.36,33.99 IC2.7
N$23
  Top 0.203: R7.2 34.61,38.1 33.66,37.15 33.66,35.24 33.06,34.64 IC2.8
N$24
  Top 0.203: IC2.9 32.75,35.29 33.02,35.56 33.02,38.42 34.61,40 R8.2
N$25
  Top 0.203: R9.1 20,43.81 22.07,41.75 22.07,37.31 23.43,35.95 IC2.11
N$26
  Top 0.203: R10.1 20,41.27 21.27,40 21.27,36.83 22.81,35.29 IC2.12
N$27
  Top 0.203: R11.1 19.69,38.73 20.32,38.1 20.32,36.51 22.19,34.64 IC2.13
N$28
  Top 0.203: R12.1 19.53,36.2 21.73,33.99 IC2.14
N$29
  Top 0.203: R13.1 19.69,33.66 20,33.34 IC2.15
N$30
  Top 0.203: R14.1 19.69,31.12 21.27,32.7 IC2.16
N$31
  Top 0.203: R15.1 19.69,28.58 20.32,29.21 20.32,30.48 21.89,32.05 IC2.17
N$32
  Top 0.203: IC2.18 22.35,31.4 21.11,30.16 21.11,27.46 19.69,26.04 R16.1
N$33  (via drill 0.35)
  Top 0.305: IC1.21 40.09,35.16 v39.69,35.56 | v41.27,28.26 42.17,28.26 C16.1 | v41.27,28.26 40.27,28.26 C17.1 | v41.27,28.26 41.27,24.02 FB1.2
  Bottom 0.61: v39.69,35.56 39.69,29.85 v41.27,28.26
N$34
  Top 0.203: TP1.1 C6.1 SW2.1 SW2.2
N$35
  Top 0.203: C6.2 SW2.3 80.65,37.46 R42.1
N$37
  Top 0.203: IC5.5 75.95,36.25 76.74,35.47 | 76.74,35.47 D2.1 D1.2 | 76.74,35.47 77.2,35.93 R42.2 76.84,37.84 C9.1 R41.2
N$38
  Top 0.203: IC1.11 46.92,40.25 46.99,40.32 J2.1
N$39
  Top 0.203: IC1.8 50.42,38.36 51.43,39.37 51.43,40 52.07,40.64 J3.1
N$44
  Top 0.305: IC10.1 43.5,23.18 44.45,24.13 47.62,24.13 48.58,23.18 IC10.3 R21.2 R22.1
N$49
  Top 0.203: R17.2 34.54,42.81 IC3.2
N$50
  Top 0.203: IC3.3 36.16,43.46 37.9,45.2 R18.2
N$51
  Top 0.203: IC3.4 35.22,44.11 37.46,46.35 40.96,46.35 41.27,46.04 R19.2
N$52
  Top 0.203: IC3.5 34.92,44.76 37.15,46.99 42.54,46.99 43.18,46.35 R20.2
N$56
  Top 0.203: IC3.9 34.34,47.36 35.88,48.89 R24.2
N$57
  Top 0.203: IC3.11 24.38,48.01 23.18,49.21 23.18,53.02 19.69,56.52 R25.1
N$61
  Top 0.203: R29.1 20,53.98 22.38,51.59 22.38,47.47 24.44,45.41 IC3.15
N$62
  Top 0.203: R30.1 20,51.43 21.59,49.85 21.59,46.99 23.82,44.76 IC3.16
N$63
  Top 0.203: R31.1 20,48.89 20.64,48.26 20.64,46.67 23.18,44.13 25.7,44.13 IC3.17
N$64
  Top 0.203: IC3.18 22.74,43.46 19.84,46.35 R32.1
N$65
  Top 0.203: IC8.5 49.41,45.72 R43.1
N$66
  Top 0.305: IC1.30 46.92,28.77 C2.1
N$67
  Top 0.305: IC1.31 47.72,28.75 C3.1
N$68
  Top 0.203: IC8.1 R44.2
N$69
  Top 0.203: R44.1 56.95,54.18 IC9.5
V+
  Top 0.61: C18.1 41.27,18.39 IC6.4 | IC11.3 66.62,21.59 C23.1
  Bottom 0.61: 41.27,12.7 61.59,12.7 64.14,15.24 IC11.3 | CON1.4 CON1.3 13.65,20.96 21.91,12.7 41.27,12.7 | IC6.4 41.27,12.7
V-
  Top 0.61: C24.2 74.98,20 73.34,20 IC12.2
  Bottom 0.61: IC12.2 71.76,13.97 69.53,11.75 21.27,11.75 14.61,18.42 CON1.1 CON1.2
VREF
  Top 0.305: IC1.1 50.42,32.76 52.07,31.12 C19.1 52.15,28.29 C20.1 54.64,28.29 53.34,26.99 53.34,23.23 R21.1

### Text on the board
tPlace: ADC 20MS/s v1